# EAGLE schematic envilator (EAGLE 5.11)

## Sheet 1 of 2
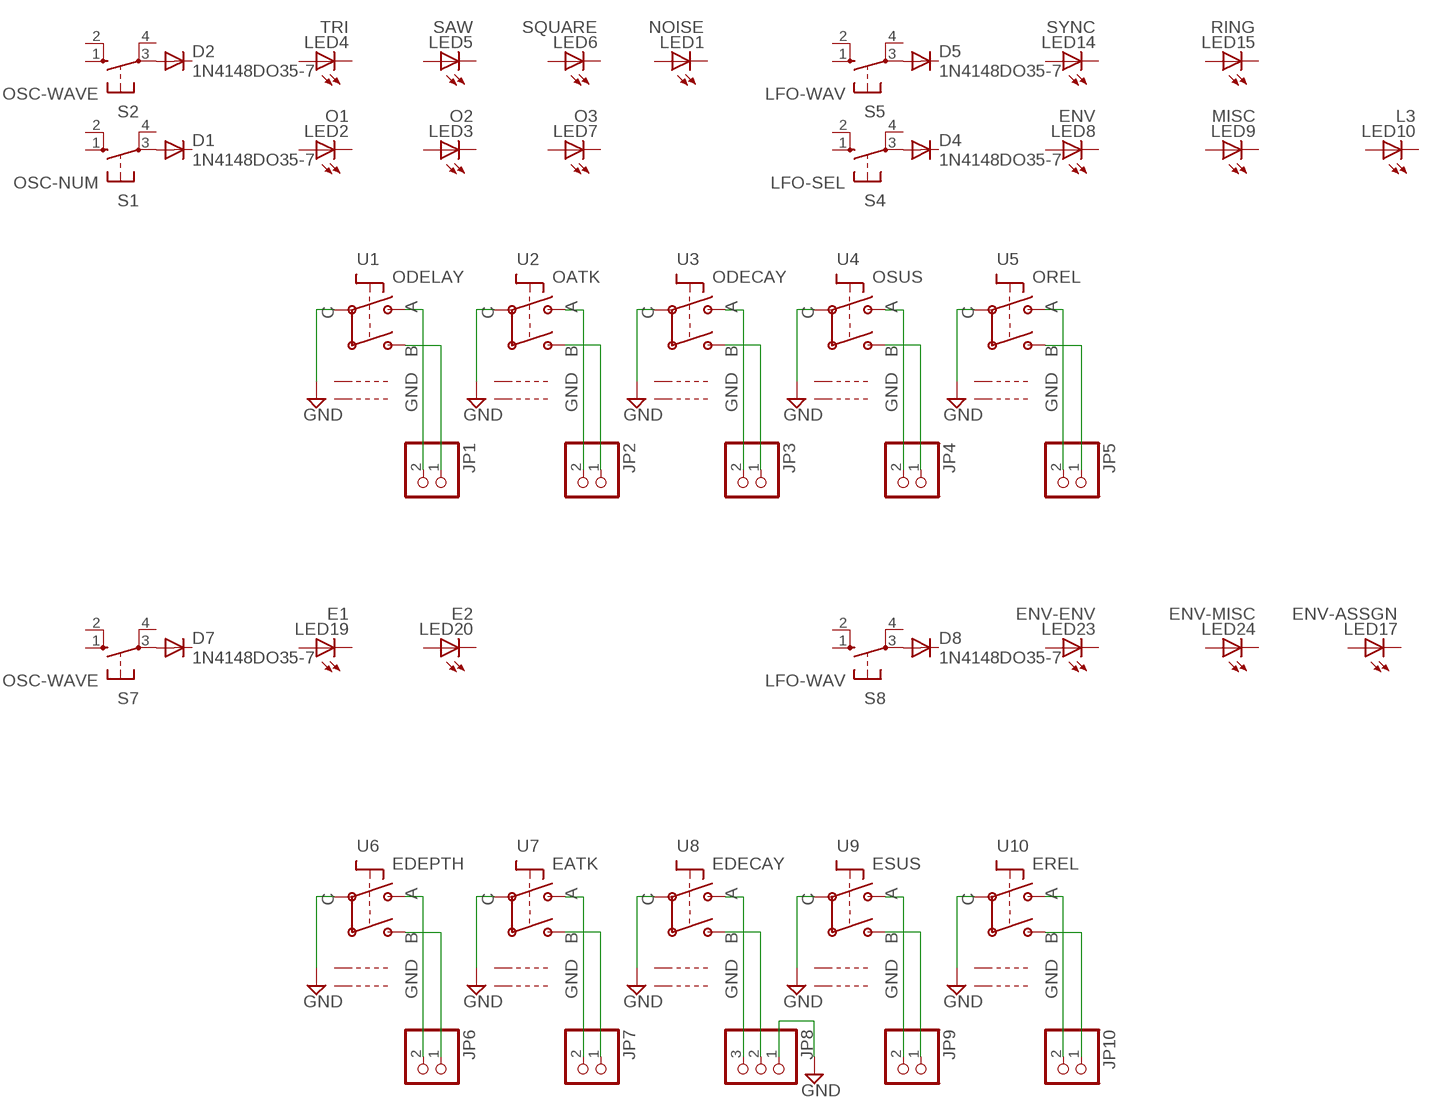
[diagram p0: schematic, sheet 1]

### Parts
D1  1N4148DO35-7  [DO35-7]
D2  1N4148DO35-7  [DO35-7]
D4  1N4148DO35-7  [DO35-7]
D5  1N4148DO35-7  [DO35-7]
D7  1N4148DO35-7  [DO35-7]
D8  1N4148DO35-7  [DO35-7]
JP1  PINHD-1X2  [1X02]
JP2  PINHD-1X2  [1X02]
JP3  PINHD-1X2  [1X02]
JP4  PINHD-1X2  [1X02]
JP5  PINHD-1X2  [1X02]
JP6  PINHD-1X2  [1X02]
JP7  PINHD-1X2  [1X02]
JP8  PINHD-1X3  [1X03]
JP9  PINHD-1X2  [1X02]
JP10  PINHD-1X2  [1X02]
LED1  NOISE  LED3MM  [LED3MM]
LED2  O1  LED3MM  [LED3MM]
LED3  O2  LED3MM  [LED3MM]
LED4  TRI  LED3MM  [LED3MM]
LED5  SAW  LED3MM  [LED3MM]
LED6  SQUARE  LED3MM  [LED3MM]
LED7  O3  LED3MM  [LED3MM]
LED8  ENV  LED3MM  [LED3MM]
LED9  MISC  LED3MM  [LED3MM]
LED10  L3  LED3MM  [LED3MM]
LED14  SYNC  LED3MM  [LED3MM]
LED15  RING  LED3MM  [LED3MM]
LED17  ENV-ASSGN  LED3MM  [LED3MM]
LED19  E1  LED3MM  [LED3MM]
LED20  E2  LED3MM  [LED3MM]
LED23  ENV-ENV  LED3MM  [LED3MM]
LED24  ENV-MISC  LED3MM  [LED3MM]
S1  OSC-NUM  10-XX  [B3F-10XX]
S2  OSC-WAVE  10-XX  [B3F-10XX]
S4  LFO-SEL  10-XX  [B3F-10XX]
S5  LFO-WAV  10-XX  [B3F-10XX]
S7  OSC-WAVE  10-XX  [B3F-10XX]
S8  LFO-WAV  10-XX  [B3F-10XX]
U1  ODELAY  ENC_ALPS_STEC16  [STEC16]
U2  OATK  ENC_ALPS_STEC16  [STEC16]
U3  ODECAY  ENC_ALPS_STEC16  [STEC16]
U4  OSUS  ENC_ALPS_STEC16  [STEC16]
U5  OREL  ENC_ALPS_STEC16  [STEC16]
U6  EDEPTH  ENC_ALPS_STEC16  [STEC16]
U7  EATK  ENC_ALPS_STEC16  [STEC16]
U8  EDECAY  ENC_ALPS_STEC16  [STEC16]
U9  ESUS  ENC_ALPS_STEC16  [STEC16]
U10  EREL  ENC_ALPS_STEC16  [STEC16]

### Nets
GND: JP8.1 U1.P$C U2.P$C U3.P$C U4.P$C U5.P$C U6.P$C U7.P$C U8.P$C U9.P$C U10.P$C
N$1: JP1.2 U1.P$A
N$2: JP1.1 U1.P$B
N$3: D2.A S2.3(P)
N$4: JP2.2 U2.P$A
N$5: JP2.1 U2.P$B
N$6: JP3.2 U3.P$A
N$7: JP3.1 U3.P$B
N$8: JP5.1 U5.P$B
N$9: JP4.2 U4.P$A
N$10: JP4.1 U4.P$B
N$11: D1.A S1.3(P)
N$12: D4.A S4.3(P)
N$15: JP6.2 U6.P$A
N$16: JP6.1 U6.P$B
N$17: JP7.2 U7.P$A
N$18: D5.A S5.3(P)
N$19: JP5.2 U5.P$A
N$20: JP7.1 U7.P$B
N$21: JP8.3 U8.P$A
N$22: JP8.2 U8.P$B
N$23: JP9.2 U9.P$A
N$24: JP9.1 U9.P$B
N$25: D7.A S7.3(P)
N$26: D8.A S8.3(P)
N$27: JP10.1 U10.P$B
N$28: JP10.2 U10.P$A
Unconnected: D1.C D2.C D4.C D5.C D7.C D8.C LED1.A LED1.K(C) LED2.A LED2.K(C) LED3.A LED3.K(C) LED4.A LED4.K(C) LED5.A LED5.K(C) LED6.A LED6.K(C) LED7.A LED7.K(C) LED8.A LED8.K(C) LED9.A LED9.K(C) LED10.A LED10.K(C) LED14.A LED14.K(C) LED15.A LED15.K(C) LED17.A LED17.K(C) LED19.A LED19.K(C) LED20.A LED20.K(C) LED23.A LED23.K(C) LED24.A LED24.K(C) S1.1(S) S1.2(S1) S1.4(P1) S2.1(S) S2.2(S1) S2.4(P1) S4.1(S) S4.2(S1) S4.4(P1) S5.1(S) S5.2(S1) S5.4(P1) S7.1(S) S7.2(S1) S7.4(P1) S8.1(S) S8.2(S1) S8.4(P1) U1.P$GND1 U1.P$GND2 U2.P$GND1 U2.P$GND2 U3.P$GND1 U3.P$GND2 U4.P$GND1 U4.P$GND2 U5.P$GND1 U5.P$GND2 U6.P$GND1 U6.P$GND2 U7.P$GND1 U7.P$GND2 U8.P$GND1 U8.P$GND2 U9.P$GND1 U9.P$GND2 U10.P$GND1 U10.P$GND2

## Sheet 2 of 2

## Library data of the parts
D1 D2 D4 D5 D7 D8 = diode:1N4148: DIODE high speed (Philips)
JP1-JP7 JP9 JP10 = pinhead:PINHD-1X2: PIN HEADER
JP8 = pinhead:PINHD-1X3: PIN HEADER
LED1-LED10 LED14 LED15 LED17 LED19 LED20 LED23 LED24 = led:LED: LED OSRAM: - CHIPLED LG R971, LG N971, LY N971, LG Q971, LY Q971, LO R971, LY R971 LH N974, LH R974 LS Q976, LO Q976, LY Q976 LO Q996 - Hyper CHIPLED LW Q18S LB Q993, LB Q99A, LB R99A - SideLED LS A670, LO A670, LY A670, LG A670, LP A670 LB A673, LV A673, LT A673, LW A673 LH A674 LY A675 LS A676, LA A676, LO A676, LY A676, LW A676 LS A679, LY A679, LG A679 - Hyper Micro SIDELED® LS Y876, LA Y876, LO Y876, LY Y876 LT Y87S - SmartLED LW L88C, LW L88S LB L89C, LB L89S, LG L890 LS L89K, LO L89K, LY L89K LS L896, LA L896, LO L896, LY L896 - TOPLED LS T670, LO T670, LY T670, LG T670, LP T670 LSG T670, LSP T670, LSY T670, LOP T670, LYG T670 LG T671, LOG T671, LSG T671 LB T673, LV T673, LT T673, LW T673 LH T674 LS T676, LA T676, LO T676, LY T676, LB T676, LH T676, LSB T676, LW T676 LB T67C, LV T67C, LT T67C, LS T67K, LO T67K, LY T67K, LW E67C LS E67B, LA E67B, LO E67B, LY E67B, LB E67C, LV E67C, LT E67C LW T67C LS T679, LY T679, LG T679 LS T770, LO T770, LY T770, LG T770, LP T770 LB T773, LV T773, LT T773, LW T773 LH T774 LS E675, LA E675, LY E675, LS T675 LS T776, LA T776, LO T776, LY T776, LB T776 LHGB T686 LT T68C, LB T68C - Hyper Mini TOPLED® LB M676 - Mini TOPLED Santana® LG M470 LS M47K, LO M47K, LY M47K Source: http://www.osram.convergy.de LUXEON: - LUMILED® LXK2-PW12-R00, LXK2-PW12-S00, LXK2-PW14-U00, LXK2-PW14-V00 LXK2-PM12-R00, LXK2-PM12-S00, LXK2-PM14-U00 LXK2-PE12-Q00, LXK2-PE12-R00, LXK2-PE12-S00, LXK2-PE14-T00, LXK2-PE14-U00 LXK2-PB12-K00, LXK2-PB12-L00, LXK2-PB12-M00, LXK2-PB14-N00, LXK2-PB14-P00, LXK2-PB14-Q00 LXK2-PR12-L00, LXK2-PR12-M00, LXK2-PR14-Q00, LXK2-PR14-R00 LXK2-PD12-Q00, LXK2-PD12-R00, LXK2-PD12-S00 LXK2-PH12-R00, LXK2-PH12-S00 LXK2-PL12-P00, LXK2-PL12-Q00, LXK2-PL12-R00 Source: www.luxeon.com KINGBRIGHT: KA-3528ASYC Source: www.kingbright.com
S1 S2 S4 S5 S7 S8 = switch-omron:10-XX: OMRON SWITCH; MPN: B3F-1000; OC_FARNELL: 176432; OC_NEWARK: 36M3542
U1-U10 = encoder:ENC